# EAGLE design i3 Botao (EAGLE 6.1)
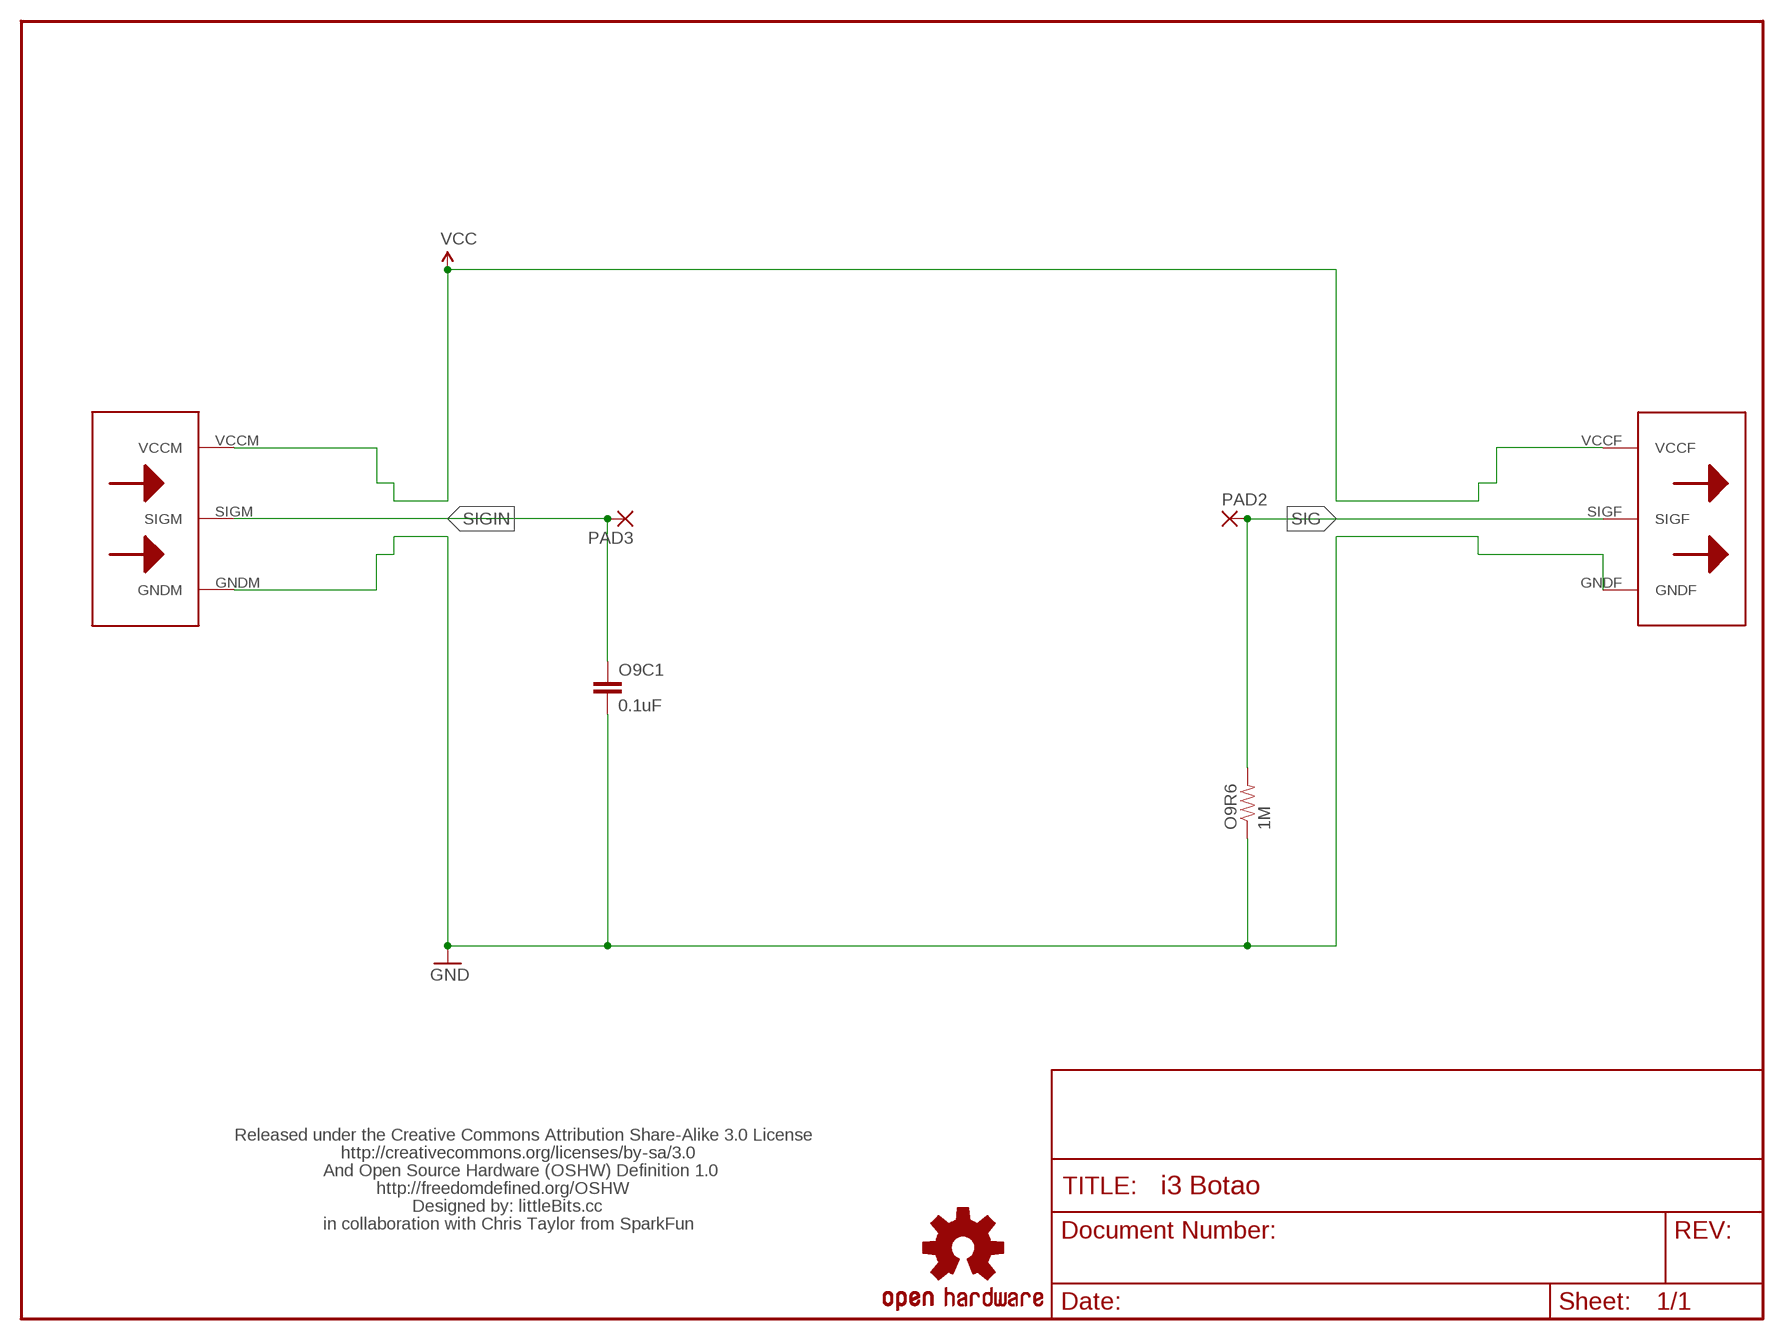
[diagram p0: schematic, sheet 1]

## Parts
O9C1  0.1uF  CAP1206  [1206]
O9R6  1M  RESISTOR  [0805]
PAD2  SMD5  [SMD2,54-5,08]
PAD3  SMD5  [SMD2,54-5,08]
U$1  LB_CREDITS  [OSHWCREDIT]
U$2  BIGBIT  [BIGBIT]
U$3  OSHW-LOGOL  [OSHW-LOGO-L]

## Nets
GND: O9C1.2 O9R6.1 U$2.GNDF U$2.GNDM
SIG: O9R6.2 PAD2.1(P) U$2.SIGF
SIGIN: O9C1.1 PAD3.1(P) U$2.SIGM
VCC: U$2.VCCF U$2.VCCM

## Library data of the parts
O9C1 = SparkFun:CAP: Capacitor Standard 0603 ceramic capacitor, and 0.1" leaded capacitor.
O9R6 = SparkFun:RESISTOR: Resistor Basic schematic elements and footprints for 0603, 1206, and PTH 1/10th watt (small) resistors.
PAD2 PAD3 = wirepad:SMD5: SMD PAD
U$1 = LITTLEBITS:LB_CREDITS
U$2 = bigbits:BIGBIT: BigBit completo Male entra o Sinal Female sai o Sinal Esquerda --> Direita
U$3 = SparkFun:OSHW-LOGO: Open Source Hardware Logo This logo indicates the piece of hardware it is found on incorporates a OSHW license and/or adheres to the definition of open source hardware found here: http://freedomdefined.org/OSHW

## Board
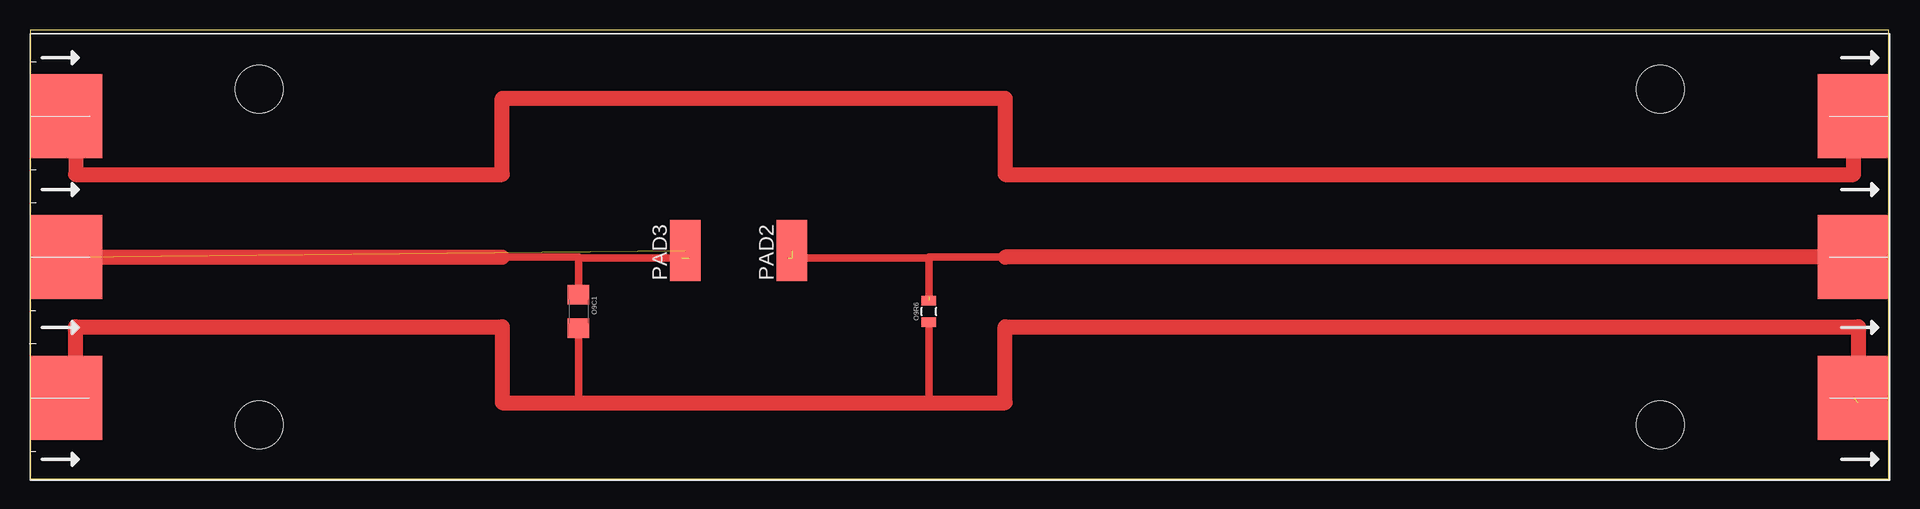
[diagram p1: board, top side]

Size 154.92 x 37.45 mm. Coordinates in mm from the lower left corner, seen from the top.
Outline: 0,0 154.92,0 154.92,37.45 0,37.45 0,0
Copper layers (1*16): Top 0.035mm / dielectric 1.5mm / Bottom 0.035mm
Design rules: minimum track width 10mil, minimum drill 24mil, track to track 8mil, track to pad 8mil, pad to pad 8mil, via to via 8mil, smd to smd 8mil, copper to edge 40mil, drill to drill 8mil, minimum pad ring 10mil, minimum via ring 8mil, stop-mask expansion 4mil, vias tented up to drill 0mil, thermal gap 10mil

### Footprints (pad centres in the part's own frame; a part is rotated, then mirrored left to right if it is on the bottom)
1206 = smd 1.6 x 1.8: 1 -1.4,0; 2 1.4,0
0805 = smd 0.8 x 1.2: 1 -0.9,0; 2 0.9,0
SMD2,54-5,08 = smd 2.54 x 5.08: 1 0,0
BIGBIT = smd 6 x 7: GNDF 152,-30.38; GNDM 3,-30.38; SIGF 152,-18.64; SIGM 3,-18.64; VCCF 152,-6.89; VCCM 3,-6.89 | hole 4: 135.9,-4.64; 135.9,-32.639; 19.1,-4.64; 19.1,-32.639

### Placement (x,y rotation side)
O9C1  45.72,13.97 270 top
O9R6  74.93,13.97 90 top
PAD2  63.5,19.05 0 top
PAD3  54.61,19.05 0 top
U$1  -48.26,1.27 0 top  (outside the outline)
U$2  0,37.15 0 top
U$3  -31.75,30.48 0 top  (outside the outline)

### Tracks (layer width: path | path; a pad name or v marks a point on that pad's centre or on a via)
GND  (1 unrouted)
  Top 0.61: O9C1.2 45.72,6.35 | O9R6.1 74.93,6.35
  Top 1.27: U$2.GNDM 3.81,6.77 3.81,12.7 39.37,12.7 39.37,6.35 45.72,6.35 74.93,6.35 81.28,6.35 81.28,12.7 152.4,12.7 152.4,6.35
SIG  (3 unrouted)
  Top 0.61: 81.28,18.51 74.93,18.51 74.93,18.41 | 74.93,18.41 74.93,15.24 | 74.93,18.41 63.18,18.41
  Top 1.27: U$2.SIGF 81.28,18.51
SIGIN  (2 unrouted)
  Top 0.61: 39.37,18.51 45.72,18.51 45.72,18.41 | 45.72,18.41 O9C1.1 | 45.72,18.41 54.93,18.41
  Top 1.27: U$2.SIGM 39.37,18.51
VCC
  Top 1.27: U$2.VCCM 3.81,30.26 3.81,25.4 39.37,25.4 39.37,31.75 81.28,31.75 81.28,25.4 152,25.4 U$2.VCCF